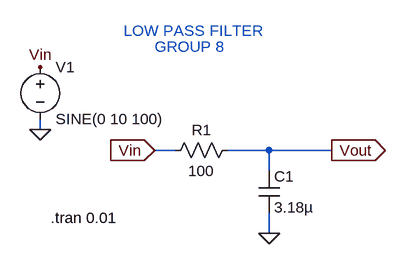
[diagram p0: schematic LPF.asc]
LPF.asc, the LTspice schematic file:
Version 4
SHEET 1 880 680
WIRE 64 224 64 208
WIRE 272 256 240 256
WIRE 416 256 352 256
WIRE 512 256 416 256
WIRE 416 288 416 256
WIRE 416 384 416 352
FLAG 64 224 0
FLAG 416 384 0
FLAG 64 128 Vin
FLAG 240 256 Vin
IOPIN 240 256 In
FLAG 512 256 Vout
IOPIN 512 256 Out
SYMBOL voltage 64 112 R0
WINDOW 123 0 0 Left 0
WINDOW 39 0 0 Left 0
SYMATTR InstName V1
SYMATTR Value SINE(0 10 100)
SYMBOL res 368 240 R90
WINDOW 0 0 56 VBottom 2
WINDOW 3 32 56 VTop 2
SYMATTR InstName R1
SYMATTR Value 100
SYMBOL cap 400 288 R0
SYMATTR InstName C1
SYMATTR Value 3.18µ
TEXT 80 360 Left 2 !.tran 0.01
TEXT 192 72 Left 2 ;LOW PASS FILTER
TEXT 240 96 Left 2 ;GROUP 8

The netlist it stands for:
* LPF.asc
V1 Vin 0 SINE(0 10 100)
R1 Vout Vin 100
C1 Vout 0 3.18µ
.tran 0.01
* LOW PASS FILTER
* GROUP 8
.backanno
.end